# EAGLE board Calliope mini rev2.0 (EAGLE 7.7.0)
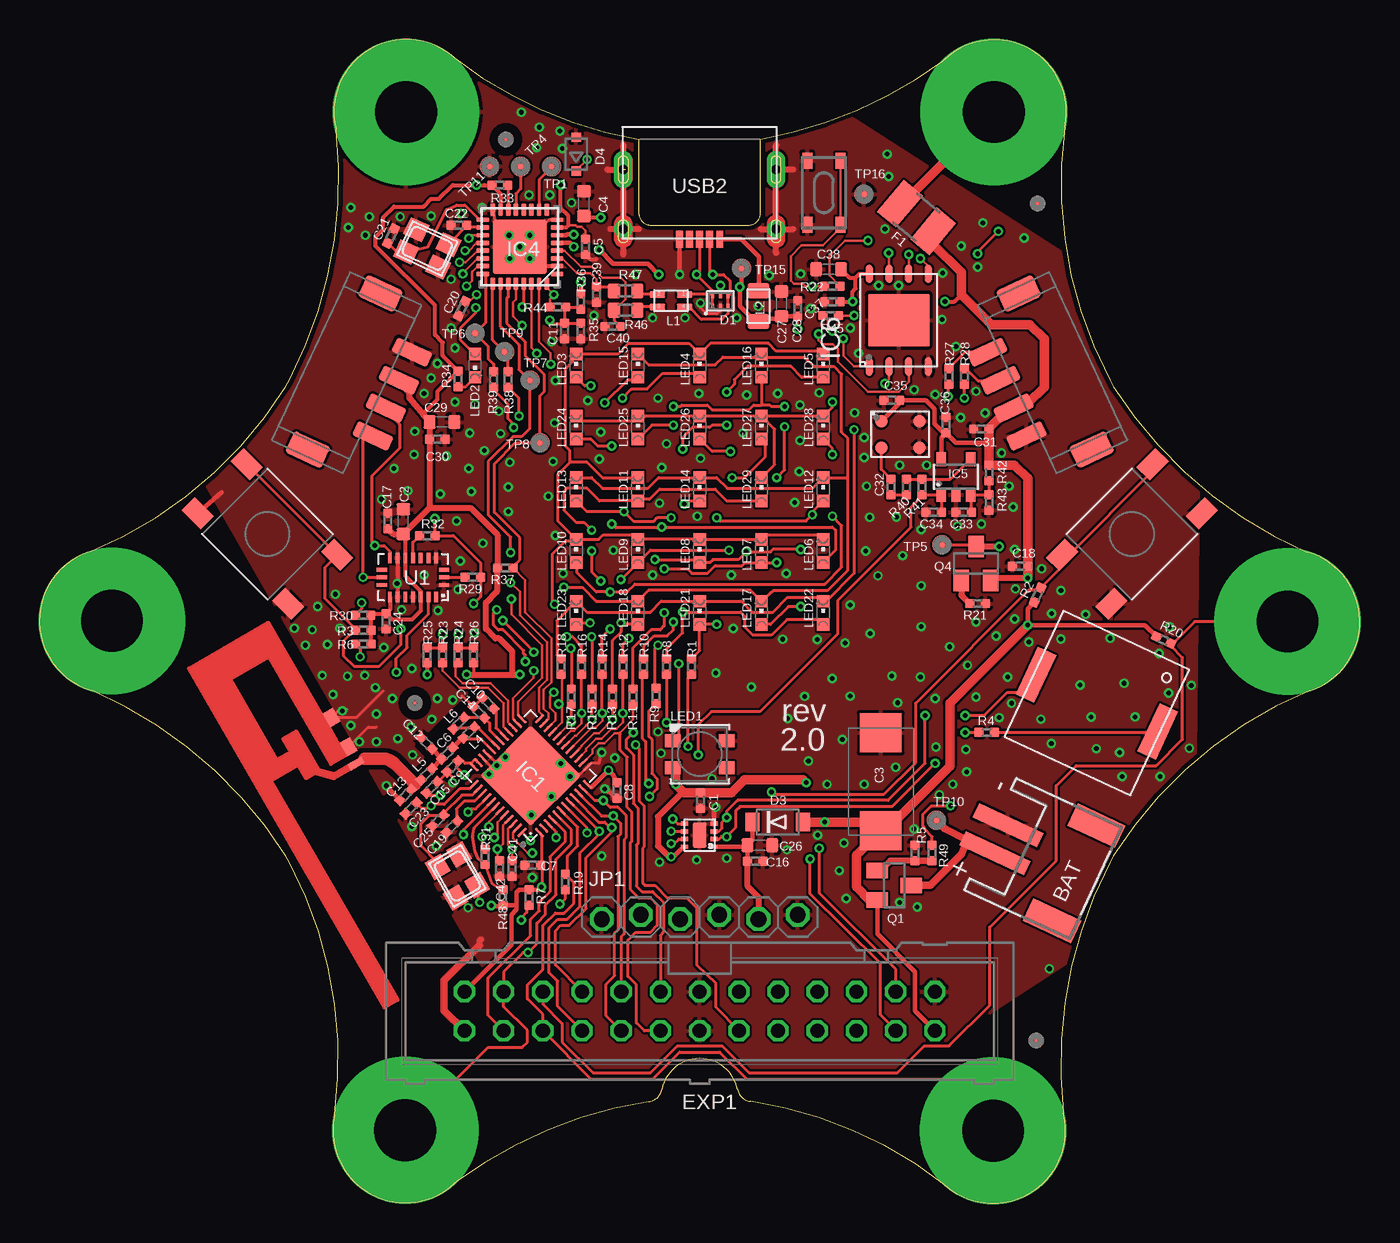
[diagram p3: board, top side]
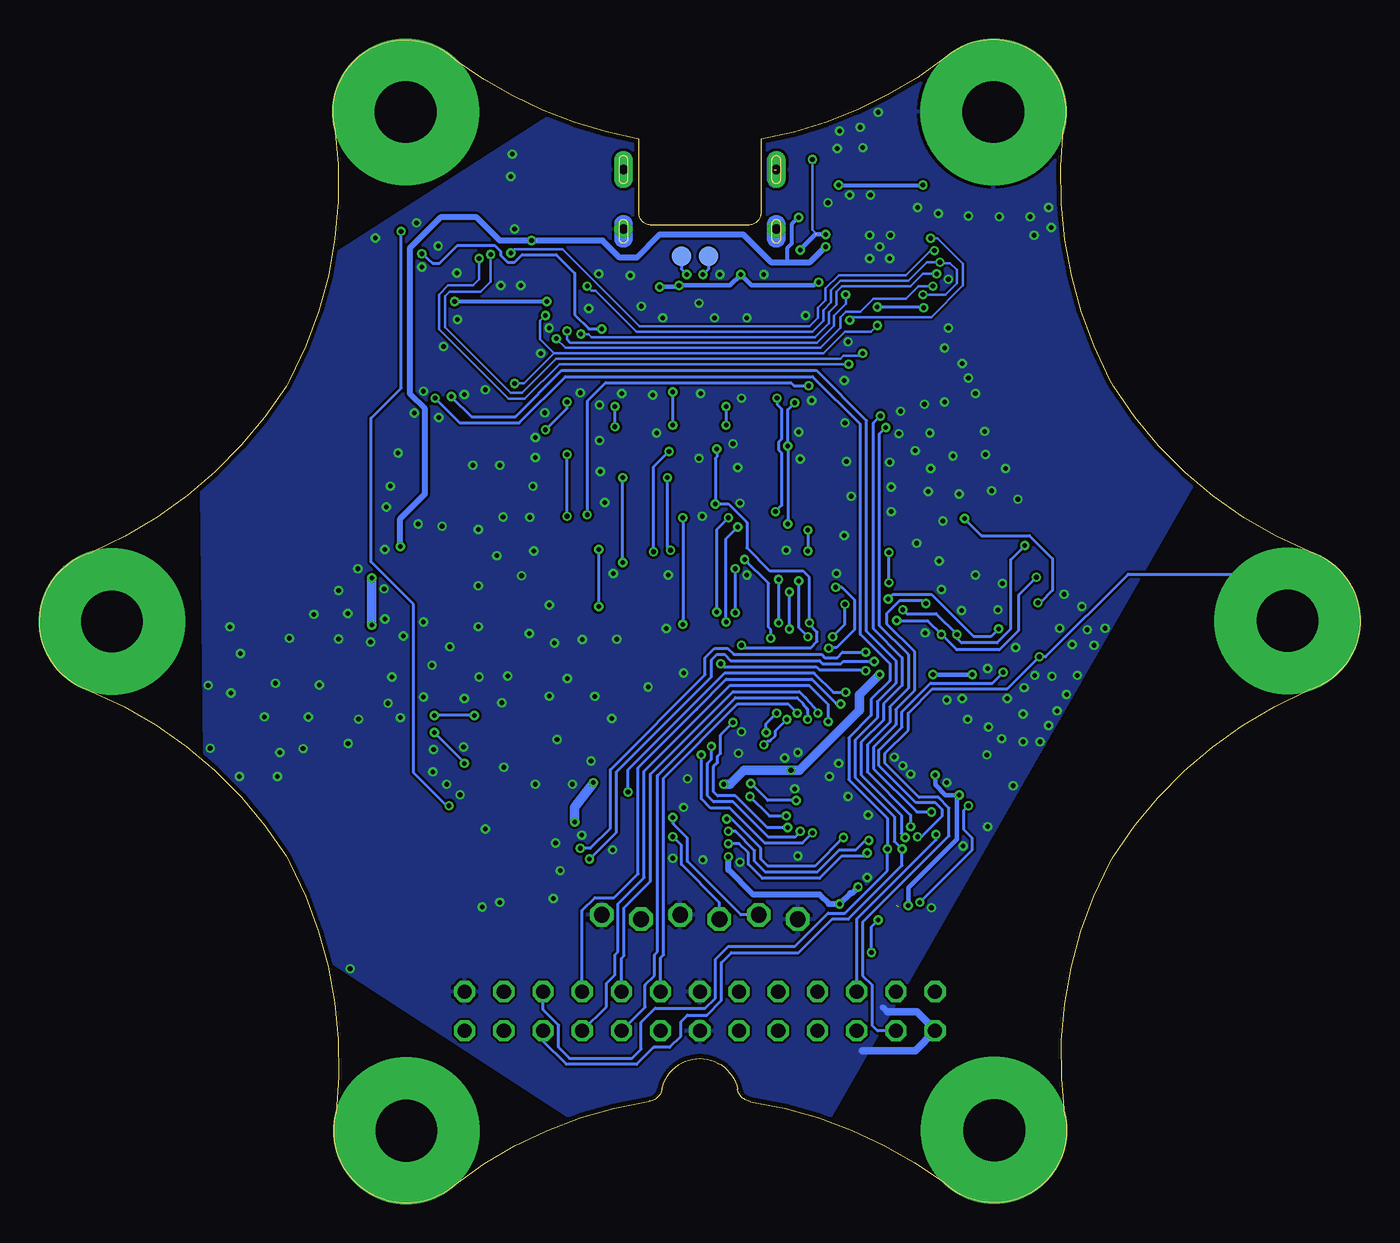
[diagram p4: board, bottom side, seen from below]

Size 85.54 x 75.36 mm. Coordinates in mm from the lower left corner, seen from the top.
Outline: 38.82,68.88 38.82,68.89
Outline: 46.72,64.13 arc-90 45.92,63.33 39.62,63.33 arc-90 38.82,64.13 38.82,68.89 arc-28 26.9,74.16 arc146 19.21,69.54 arc-34 16.21,53.31 15.96,52.87 arc-36 3.25,42.18 arc146 3.4,33.2 arc-34 15.96,22.5 16.21,22.05 arc-36 19.11,5.7 arc146 26.96,1.35 arc-28 39.49,6.57 arc70 40.32,7.36 arc-157 45.22,7.37 arc70 46.05,6.59 arc-29 58.64,1.2 arc146 66.33,5.83 arc-34 69.33,22.05 69.58,22.5 arc-36 82.3,33.18 arc146 82.14,42.16 arc-34 69.58,52.87 69.33,53.31 arc-36 66.43,69.66 arc146 58.58,74.01 arc-26 46.72,68.9 46.72,68.88
Copper layers (1*16): Top 0.035mm / dielectric 1.55mm / Bottom 0.035mm
Design rules "eC_2Layer_PClass6_BaseCopperO35 *": minimum track width 0.15mm, minimum drill 0.3mm, track to track 0.15mm, track to pad 0.15mm, pad to pad 0.15mm, via to via 0.15mm, smd to smd 0mil, copper to edge 0.3mm, drill to drill 0.35mm, minimum pad ring 0.175mm, minimum via ring 0.15mm, stop-mask expansion 0.05mm, vias tented up to drill 0.45mm, thermal gap 0.2mm
tKeepout: area 18,64.9 to 29.5,76.4; area 56.1,64.9 to 67.6,76.4; area 75.1,31.9 to 86.6,43.4; area 56,-1.1 to 67.5,10.4; area 18,-1 to 29.5,10.5; area 35.8,63.9 to 37.8,69.9; area 35.8,62.5 to 37.8,68.5; area 35.8,60.5 to 41.8,62.5; area 41.8,60.5 to 47.8,62.5; area 47.8,60.5 to 49.8,66.5; area 47.8,64.5 to 49.8,70.5; area 48.1,67.7 to 54.1,69.7; area 52.2,63.7 to 54.2,69.7; area 52.2,63.1 to 54.2,69.1; area 48.2,61.1 to 54.2,63.1; area 66.1,23.7 to 72.4,28.1; area 63,25.1 to 69.3,29.5; area 59.6,24.1 to 63.9,30.4; area 57.8,20.4 to 62.2,26.7; area 57,16.9 to 63.3,21.3; area 61.7,14.7 to 68,19.1; area 22.5,5.7 to 28.5,7.7; area 28.5,5.7 to 34.5,7.7; area 34.5,5.7 to 40.5,7.7; area 40.5,5.7 to 46.5,7.7; area 46.5,5.7 to 52.5,7.7; area 52.5,5.7 to 58.5,7.7; area 57.1,5.7 to 63.1,7.7; area 63.1,5.7 to 65.1,11.7; area 63.1,11.7 to 65.1,17.7; area 59.1,16.9 to 65.1,18.9; area 53.1,16.9 to 59.1,18.9; area 47.1,16.9 to 53.1,18.9; area 41.1,16.9 to 47.1,18.9; area 35.1,16.9 to 41.1,18.9; area 29.1,16.9 to 35.1,18.9; area 23.1,16.9 to 29.1,18.9; area 22.4,16.9 to 28.4,18.9; area 20.4,12.9 to 22.4,18.9; area 20.4,6.9 to 22.4,12.9; area 43.1,19.8 to 49.1,21.8; area 49.1,15.8 to 51.1,21.8; area 37.1,19.8 to 43.1,21.8; area 36.4,19.8 to 42.4,21.8; area 34.4,15.8 to 36.4,21.8; area 14.8,37.7 to 20.4,43.4; area 66.5,36.3 to 72.2,41.9; area 70.8,37.7 to 76.4,43.3; area 67.5,46.2 to 73.8,50.6; area 64.1,44.6 to 70.4,49; area 61.5,46.4 to 65.9,52.7; area 59.7,50.2 to 64.1,56.5; area 59,51.8 to 63.3,58.1; area 58.1,57.3 to 64.4,61.6; area 60.8,58.5 to 67.1,62.9; area 65.1,37.7 to 70.8,43.3; area 63.7,41.9 to 69.4,47.6; area 67.5,45.8 to 73.2,51.4; area 73.1,40.1 to 78.8,45.7; area 16.2,42 to 21.8,47.6; area 12.4,45.7 to 18.1,51.4; area 10.5,36.3 to 16.2,42; area 6.6,40.3 to 12.2,45.9; area 19.6,46.4 to 24,52.7; area 15.2,44.6 to 21.5,48.9; area 22.2,51.8 to 26.5,58.1; area 21.1,57.3 to 27.4,61.7; area 18.5,58.6 to 24.8,62.9; area -1,31.9 to 10.5,43.4
tRestrict: 4 lines

## Footprints (pad centres in the part's own frame; a part is rotated, then mirrored left to right if it is on the bottom)
JST-PH-2-SMT-RA = smd 1 x 4.6: 1 1,-3.7; 2 -1,-3.7 | smd 1.6 x 3.4: NC1 -3.4,1.5; NC2 3.4,1.5
0402 = smd 0.6 x 0.6: 1 -0.5,0; 2 0.5,0
0603 = smd 0.8 x 0.9: 1 -0.8,0; 2 0.8,0
D/7343-31R = smd 2.55 x 2.7: + 3.175,0; - -3.175,0
SOT886 = smd 0.325 x 0.27: 1 -0.338,0.5; 2 -0.338,0; 3 -0.338,-0.5; 4 0.338,-0.5; 5 0.338,0; 6 0.338,0.5
SOD-123FL = smd 0.91 x 1.22: A 1.637,0; C -1.637,0
SOD323-R = smd 0.6 x 0.6: A 1.1,0; C -1.1,0
ML26 = drill 0.914 octagon: 1 -15.24,-1.27; 2 -15.24,1.27; 3 -12.7,-1.27; 4 -12.7,1.27; 5 -10.16,-1.27; 6 -10.16,1.27; 7 -7.62,-1.27; 8 -7.62,1.27; 9 -5.08,-1.27; 10 -5.08,1.27; 11 -2.54,-1.27; 12 -2.54,1.27; 13 0,-1.27; 14 0,1.27; 15 2.54,-1.27; 16 2.54,1.27; 17 5.08,-1.27; 18 5.08,1.27; 19 7.62,-1.27; 20 7.62,1.27; 21 10.16,-1.27; 22 10.16,1.27; 23 12.7,-1.27; 24 12.7,1.27; 25 15.24,-1.27; 26 15.24,1.27
R1210 = smd 1.6 x 2.7: 1 -1.4,0; 2 1.4,0
1125S-SMT-XP = smd 1 x 2.5: 1 3,0.325; 2 1,0.325; 3 -1,0.325; 4 -3,0.325 | smd 1.55 x 2.6: P$1 5.575,-3.125; P$2 -5.575,-3.125
QFN48 = smd 0.8 x 0.2: 1 -3,2.2; 2 -3,1.8; 3 -3,1.4; 4 -3,1; 5 -3,0.6; 6 -3,0.2; 7 -3,-0.2; 8 -3,-0.6; 9 -3,-1; 10 -3,-1.4; 11 -3,-1.8; 12 -3,-2.2; 25 3,-2.2; 26 3,-1.8; 27 3,-1.4; 28 3,-1; 29 3,-0.6; 30 3,-0.2; 31 3,0.2; 32 3,0.6; 33 3,1; 34 3,1.4; 35 3,1.8; 36 3,2.2 | smd 0.2 x 0.8: 13 -2.2,-3; 14 -1.8,-3; 15 -1.4,-3; 16 -1,-3; 17 -0.6,-3; 18 -0.2,-3; 19 0.2,-3; 20 0.6,-3; 21 1,-3; 22 1.4,-3; 23 1.8,-3; 24 2.2,-3; 37 2.2,3; 38 1.8,3; 39 1.4,3; 40 1,3; 41 0.6,3; 42 0.2,3; 43 -0.2,3; 44 -0.6,3; 45 -1,3; 46 -1.4,3; 47 -1.8,3; 48 -2.2,3 | smd 4.65 x 4.65: GND 0,0
WSON8 = smd 0.28 x 0.5: 1 -0.75,-0.925; 2 -0.25,-0.925; 3 0.25,-0.925; 4 0.75,-0.925; 5 0.75,0.975; 6 0.25,0.975; 7 -0.25,0.975; 8 -0.75,0.975 | smd 1.6 x 0.9: EP 0,0
QFN_32_5X5X0P9 = smd 0.813 x 0.305: 1 -2.402,1.75; 2 -2.402,1.25; 3 -2.402,0.75; 4 -2.402,0.25; 5 -2.402,-0.25; 6 -2.402,-0.75; 7 -2.402,-1.25; 8 -2.402,-1.75; 17 2.402,-1.75; 18 2.402,-1.25; 19 2.402,-0.75; 20 2.402,-0.25; 21 2.402,0.25; 22 2.402,0.75; 23 2.402,1.25; 24 2.402,1.75 | smd 0.305 x 0.813: 9 -1.75,-2.402; 10 -1.25,-2.402; 11 -0.75,-2.402; 12 -0.25,-2.402; 13 0.25,-2.402; 14 0.75,-2.402; 15 1.25,-2.402; 16 1.75,-2.402; 25 1.75,2.402; 26 1.25,2.402; 27 0.75,2.402; 28 0.25,2.402; 29 -0.25,2.402; 30 -0.75,2.402; 31 -1.25,2.402; 32 -1.75,2.402 | smd 3.5 x 3.5: 33 0,0
SOT23-5 = smd 0.6 x 0.9: 1 -0.95,-1.15; 2 0,-1.15; 3 0.95,-1.15; 4 0.95,1.15; 5 -0.95,1.15
VQFN8_6X5 = smd 1.2 x 0.45: 1 -3,1.905; 2 -3,0.635; 3 -3,-0.635; 4 -3,-1.905; 5 3,-1.905; 6 3,-0.635; 7 3,0.635; 8 3,1.905 | smd 3.4 x 4: EP 0,0
1X06-OFF = drill 1.016 octagon: 1 -6.35,-0.14; 2 -3.81,0.14; 3 -1.27,-0.14; 4 1.27,0.14; 5 3.81,-0.14; 6 6.35,0.14
USB_2.0_FILTER_0805 = smd 1 x 0.45: 1 0.88,0.405; 2 -0.88,0.405; 3 -0.88,-0.405; 4 0.88,-0.405
FERRIT_0805 = smd 1 x 1.4: 1 -1,0; 2 1,0
LED3535 = smd 1 x 0.85: 1 -1.75,0.875; 2 -1.75,-0.875; 3 1.75,-0.875; 4 1.75,0.875
CHIPLED_0603 = smd 0.8 x 0.8: A 0,-0.75; C 0,0.75
SPU0410HR5H-PB = smd 0.8 x 0.8: 1 0.85,1.23; 2 0.85,-1.23; 3 -0.85,-1.23; 4 -0.85,1.23
BANANA_REC = drill 4 pad 9.5: 1 0,0
SOT23 = smd 1 x 1.4: 1 -0.95,-1.1; 2 0.95,-1.1; 3 0,1.1
NX3225 = smd 1.3 x 1.2: 1 -1.15,-0.8; 2 1.15,-0.8; 3 1.15,0.8; 4 -1.15,0.8
R0603 = smd 0.8 x 1: 1 -0.75,0; 2 0.75,0
PKMCS = smd 1.3 x 3.4: 1 -4.35,0; 2 4.35,0
PTS645S = smd 1.74 x 1.2: 1 -4.145,2.25; 2 4.145,2.25; 3 -4.145,-2.25; 4 4.145,-2.25
PTS810 = smd 1.05 x 0.65: 1 -2.075,1.075; 2 2.075,1.075; 3 -2.075,-1.075; 4 2.075,-1.075
B1,27 = smd 1.27 x 1.27: TP 0,0
BMX055 = smd 0.675 x 0.25: 1 1.262,1.5; 2 1.262,1; 3 1.262,0.5; 4 1.262,0; 5 1.262,-0.5; 6 1.262,-1; 7 1.262,-1.5; 11 -1.262,-1.5; 12 -1.262,-1; 13 -1.262,-0.5; 14 -1.262,0; 15 -1.262,0.5; 16 -1.262,1; 17 -1.262,1.5 | smd 0.25 x 0.675: 8 0.5,-2.013; 9 0,-2.013; 10 -0.5,-2.013; 18 -0.5,2.013; 19 0,2.013; 20 0.5,2.013
DN0007+0_MIRROR = smd 0.46 x 1 bottom: FEED 2.22,-2.8 | smd 1.01 x 0.74 bottom: GND -1.16,-2.93; GND@1 1.035,-2.93
FIDUCIAL_1MM = smd 1 x 1: 1 0,0
47642-0001 = smd 0.45 x 1.1: 1 -1.3,6.47; 2 -0.65,6.47; 3 0,6.47; 4 0.65,6.47; 5 1.3,6.47 | drill 0.6 pad 1.2 long: P$1 -4.95,1.95; P$3 4.95,1.95 | drill 0.6 pad 1.2: P$2 -4.95,5.8; P$4 4.95,5.8

## Placement (x,y rotation side)
BAT  S2B-PH-SM4-TB(LF)(SN)  [JST-PH-2-SMT-RA]  65.68,22 245 top
C1  100nF/25V/10%  [0402]  42.82,26.08 270 top
C2  10uF/16V/10%  [0603]  23.57,44.13 90 top
C3  100uF/6,3V/10%  [D/7343-31R]  54.5,27.29 270 top
C4  10uF/16V/10%  [0603]  35.27,64.73 90 top
C5  100nF/25V/10%  [0402]  35.37,61.93 270 top
C6  2,2pF/50V  [0402]  26.42,29.13 225 top
C7  100nF/25V/10%  [0402]  31.97,21.88 180 top
C8  100nF/25V/10%  [0402]  37.42,26.73 270 top
C9  1nF/25V/5%  [0402]  26.77,28.28 225 top
C10  47nF/25V/10%  [0402]  29.07,32.38 135 top
C11  100nF/25V/10%  [0402]  34.02,56.48 270 top
C12  1,0pF/50V  [0402]  25.07,29.78 135 top
C13  1,5pF/50V  [0402]  23.72,26.43 225 top
C14  2,2nF/25V/5%  [0402]  28.47,31.78 135 top
C15  100nF/25V/10%  [0402]  25.42,26.93 45 top
C16  100nF/25V/10%  [0402]  46.37,22.13 0 top
C17  100nF/25V/10%  [0402]  22.57,44.18 90 top
C18  100nF/25V/10%  [0402]  63.52,41.23 180 top
C19  100nF/25V/10%  [0402]  26.72,24.38 225 top
C20  100nF/25V/10%  [0402]  27.37,57.93 245 top
C21  12pF/50V/1%  [0402]  22.77,62.63 65 top
C22  12pF/50V/1%  [0402]  27.17,63.33 180 top
C23  12pF/50V/1%  [0402]  24.07,25.58 225 top
C24  100nF/25V/10%  [0402]  22.47,37.68 270 top
C25  12pF/50V/1%  [0402]  25.82,24.78 225 top
C26  10uF/16V/10%  [0603]  46.67,23.18 0 top
C27  10uF/16V/10%  [0603]  48.07,58.23 90 top
C28  100nF/25V/10%  [0402]  49.12,57.93 90 top
C29  10uF/16V/10%  [0603]  26.07,50.58 0 top
C30  100nF/25V/10%  [0402]  25.77,49.48 0 top
C31  100nF/25V/10%  [0402]  61.02,50.13 180 top
C32  100nF/25V/10%  [0402]  55.17,46.38 90 top
C33  100nF/25V/10%  [0402]  59.87,44.73 180 top
C34  100nF/25V/10%  [0402]  57.92,44.73 180 top
C35  100nF/25V/10%  [0402]  55.22,51.98 180 top
C36  100nF/25V/10%  [0402]  58.72,50.38 90 top
C37  100nF/25V/10%  [0402]  51.37,58.38 180 top
C38  10uF/16V/10%  [0603]  51.12,60.48 180 top
C39  47pF/16V/5%  [0402]  36.08,58.84 270 top
C40  47pF/16V/5%  [0402]  37.13,56.77 180 top
C41  100nF/25V/10%  [0402]  30.62,21.68 270 top
C42  100nF/25V/10%  [0402]  29.82,21.68 270 top
D1  PRTR5V0U2F  [SOT886]  44.11,58.42 90 top
D3  MBR1020VL  [SOD-123FL]  47.82,24.68 0 top
D4  [SOD323-R]  34.77,67.93 90 top
EXP1  [ML26]  42.77,12.43 180 top
F1  MICROSMDCH050F-02  [R1210]  56.82,63.83 140 top
I2C  1125S-SMT-XP  [1125S-SMT-XP]  22.57,52.53 245 top
IC1  NRF51822  [QFN48]  31.82,27.68 135 top
IC3  DRV8837  [WSON8]  42.77,23.83 90 top
IC4  MKL26Z128VFM4  [QFN_32_5X5X0P9]  31.12,61.93 180 top
IC5  MCP6001  [SOT23-5]  59.37,47.03 0 top
IC6  IS25LP128F  [VQFN8_6X5]  55.67,57.18 90 top
JP1  [1X06-OFF]  42.77,18.53 0 top
L1  2x47nH  [USB_2.0_FILTER_0805]  40.91,58.44 0 top
L2  MH2029-800Y  [FERRIT_0805]  46.58,58.09 270 top
L4  4,7nH  [0402]  27.82,30.48 45 top
L5  3,3nH  [0402]  25.07,27.78 225 top
L6  10nH  [0402]  27.17,31.08 225 top
LED1  SK6812MINI  [LED3535]  42.77,29.08 0 top
LED2  gelb  [CHIPLED_0603]  28.22,54.23 180 top
LED3  rot  [CHIPLED_0603]  34.77,54.23 0 top
LED4  rot  [CHIPLED_0603]  42.77,54.23 0 top
LED5  rot  [CHIPLED_0603]  50.77,54.23 0 top
LED6  rot  [CHIPLED_0603]  50.77,42.23 0 top
LED7  rot  [CHIPLED_0603]  46.77,42.23 0 top
LED8  rot  [CHIPLED_0603]  42.77,42.23 0 top
LED9  rot  [CHIPLED_0603]  38.77,42.23 0 top
LED10  rot  [CHIPLED_0603]  34.77,42.23 0 top
LED11  rot  [CHIPLED_0603]  38.77,46.23 0 top
LED12  rot  [CHIPLED_0603]  50.77,46.23 0 top
LED13  rot  [CHIPLED_0603]  34.77,46.23 0 top
LED14  rot  [CHIPLED_0603]  42.77,46.23 0 top
LED15  rot  [CHIPLED_0603]  38.77,54.23 0 top
LED16  rot  [CHIPLED_0603]  46.77,54.23 0 top
LED17  rot  [CHIPLED_0603]  46.77,38.23 0 top
LED18  rot  [CHIPLED_0603]  38.77,38.23 0 top
LED21  rot  [CHIPLED_0603]  42.77,38.23 0 top
LED22  rot  [CHIPLED_0603]  50.77,38.23 0 top
LED23  rot  [CHIPLED_0603]  34.77,38.23 0 top
LED24  rot  [CHIPLED_0603]  34.77,50.23 0 top
LED25  rot  [CHIPLED_0603]  38.77,50.23 0 top
LED26  rot  [CHIPLED_0603]  42.77,50.23 0 top
LED27  rot  [CHIPLED_0603]  46.77,50.23 0 top
LED28  rot  [CHIPLED_0603]  50.77,50.23 0 top
LED29  rot  [CHIPLED_0603]  46.77,46.23 0 top
MIC1  SPU0410HR5H-PB  [SPU0410HR5H-PB]  55.77,49.78 90 top
P_0  BANANA_PCB  [BANANA_REC]  4.7,37.71 0 top
P_1  BANANA_PCB  [BANANA_REC]  23.7,4.72 0 top
P_2  BANANA_PCB  [BANANA_REC]  61.78,4.69 0 top
P_3  BANANA_PCB  [BANANA_REC]  80.86,37.66 0 top
P_+3V  BANANA_PCB  [BANANA_REC]  61.84,70.65 0 top
P_GND  BANANA_PCB  [BANANA_REC]  23.75,70.66 0 top
Q1  DMG2305UX  [SOT23]  55.37,20.58 270 top
Q2  16.0 Mhz  [NX3225]  27.07,21.18 120 top
Q3  16.0 Mhz  [NX3225]  25.12,61.83 335 top
Q4  DMG2305UX  [SOT23]  60.67,41.43 0 top
R1  220R/1%  [0402]  42.24,34.74 90 top
R2  100K/1%  [0402]  64.66,39.39 245 top
R3  100K/1%  [0402]  20.98,37.09 0 top
R4  0R  [0402]  61.37,30.48 0 top
R5  680k/1%  [0402]  56.72,22.68 270 top
R6  3,3M/1%  [0402]  20.99,36.21 0 top
R7  3,3M/1%  [0402]  31.73,19.79 90 top
R8  220R/1%  [0402]  40.62,34.74 90 top
R9  220R/1%  [0402]  39.95,32.84 90 top
R10  220R/1%  [0402]  39.13,34.74 90 top
R11  220R/1%  [0402]  38.46,32.79 90 top
R12  220R/1%  [0402]  37.8,34.74 90 top
R13  220R/1%  [0402]  37.13,32.79 90 top
R14  220R/1%  [0402]  36.46,34.74 90 top
R15  220R/1%  [0402]  35.79,32.79 90 top
R16  0R  [0402]  35.12,34.74 90 top
R17  0R  [0402]  34.46,32.79 90 top
R18  0R  [0402]  33.79,34.74 90 top
R19  3,3M/1%  [0402]  34.07,20.79 270 top
R20  3,3M/1%  [0402]  72.83,36.47 155 top
R21  680k/1%  [0402]  60.77,38.83 180 top
R22  10K/1%  [0402]  51.37,59.38 0 top
R23  0R  [0402]  26.12,35.48 90 top
R24  0R  [0402]  27.12,35.48 90 top
R25  2,2K/1%  [0402]  25.12,35.48 270 top
R26  2,2K/1%  [0402]  28.12,35.48 270 top
R27  100R/1%  [0402]  58.92,53.53 90 top
R28  100R/1%  [0402]  59.92,53.53 90 top
R29  10K/1%  [0402]  28.07,40.53 180 top
R30  100K/1%  [0402]  20.97,38.08 0 top
R31  10K/1%  [0402]  28.87,22.43 270 top
R32  10K/1%  [0402]  25.12,43.23 180 top
R33  10K/1%  [0402]  29.82,65.93 180 top
R34  2,2K/1%  [0402]  27.12,53.38 90 top
R35  10K/1%  [0402]  35.07,56.48 90 top
R36  10K/1%  [0402]  35.07,58.38 90 top
R37  [0402]  30.17,41.13 180 top
R38  1K/5%  [0402]  30.37,53.33 270 top
R39  1K/5%  [0402]  29.42,53.33 270 top
R40  10K/1%  [0402]  56.17,46.38 270 top
R41  1M/1%  [0402]  57.17,46.38 90 top
R42  100K/1%  [0402]  61.52,47.28 90 top
R43  100K/1%  [0402]  61.52,45.38 90 top
R44  0R  [0402]  33.57,58.03 180 top
R45  100R/1%  [0402]  51.27,57.48 0 top
R46  10R/1%  [R0603]  37.98,57.82 180 top
R47  10R/1%  [R0603]  37.98,59.07 180 top
R48  100K/1%  [0402]  30.02,19.78 270 top
R49  390k/1%  [0402]  57.82,22.68 270 top
SERIAL  1125S-SMT-XP  [1125S-SMT-XP]  62.97,52.53 115 top
SPK1  PKMCS0909E4000-R1  [PKMCS]  68.5,32.38 335 top
TAST_A  PTS645S blue  [PTS645S]  14.77,43.33 135 top
TAST_B  PTS645S red  [PTS645S]  70.77,43.33 225 top
TAST_RESET  PTS810SJ  [PTS810]  50.82,65.43 90 top
TP1  PTR1B1,27  [B1,27]  33.17,67.13 180 top
TP4  PTR1B1,27  [B1,27]  31.17,67.13 180 top
TP5  PTR1B1,27  [B1,27]  58.47,42.63 180 top
TP6  PTR1B1,27  [B1,27]  28.22,56.33 0 top
TP7  PTR1B1,27  [B1,27]  31.77,53.28 0 top
TP8  PTR1B1,27  [B1,27]  32.42,49.23 0 top
TP9  PTR1B1,27  [B1,27]  30.12,55.13 0 top
TP10  PTR1B1,27  [B1,27]  58.12,24.78 0 top
TP11  PTR1B1,27  [B1,27]  29.17,67.13 0 top
TP13  PTR1B1,27  [B1,27]  42.22,61.33 0 bottom
TP14  PTR1B1,27  [B1,27]  43.97,61.33 0 bottom
TP15  PTR1B1,27  [B1,27]  45.47,60.53 90 top
TP16  PTR1B1,27  [B1,27]  53.42,65.33 0 top
U1  BMX055  [BMX055]  24.2,40.53 270 top
U$2  INVERTED_F_ANTENNA  [DN0007+0_MIRROR]  16.97,28.98 240 bottom
U$5  FIDUCIAL  [FIDUCIAL_1MM]  64.57,10.53 0 top
U$6  FIDUCIAL  [FIDUCIAL_1MM]  30.22,68.88 0 top
U$7  FIDUCIAL  [FIDUCIAL_1MM]  64.67,64.73 0 top
U$8  FIDUCIAL  [FIDUCIAL_1MM]  24.32,32.38 0 top
USB2  47642-0001  [47642-0001]  42.77,68.88 180 top

## Tracks (layer width: path | path; a pad name or v marks a point on that pad's centre or on a via)
+5V  (via drill 0.3)  (1 unrouted)
  Top 0.15: v35.47,67.58 34.77,66.88 D4.C
  Top 0.2: D1.5 44.11,59.32 v44.12,59.43 | R49.1 57.82,23.73 57.32,24.23 57.32,24.33 57.22,24.43 57.22,25.18 57.77,25.73 v59.02,25.73 | v62.12,62.93 60.77,61.58 v60.77,61.48 | v49.12,56.61 C28.1
  Top 0.3: TP15.TP 45.47,59.48 v45.37,59.33 45.37,58.08 46.12,57.33 46.34,57.33 L2.2 46.93,57.09 47.12,57.28 47.92,57.28 C27.1 C28.1 | v35.07,59.63 R36.2 | v40.12,60.13 39.42,60.83 37.17,60.83 v36.27,61.73 | IC4.6 34.12,62.68 | 34.12,62.68 | 34.12,62.68 34.17,62.73 v34.62,62.73
  Bottom 0.15: 35.22,62.78 35.47,63.03 v35.47,67.58
  Bottom 0.2: v59.02,25.73 59.17,25.73 61.32,27.88 61.32,38.78 64.07,41.53 64.07,50.83 62.12,52.78 v62.12,62.93 | v60.77,61.48 60.07,60.88 59.62,60.88 58.47,62.03 56.07,62.03 55.67,61.63 55.67,61.38 55.22,60.93 54.77,60.93 54.27,61.43 52.07,61.43 50.87,60.23 50.87,57.53 49.95,56.61 v49.12,56.61
  Bottom 0.3: v45.37,59.33 44.22,59.33 v44.12,59.43 40.82,59.43 v40.12,60.13 39.42,59.43 35.37,59.43 v35.07,59.63 | v36.27,61.73 35.27,62.73 v34.62,62.73
FL_CS  (via drill 0.3)
  Top 0.15: IC4.23 28.37,60.68 28.02,60.33 28.02,59.73 v27.67,59.38 | IC6.1 52.76,54.18 52.07,54.87 v52.07,55.98
  Bottom 0.15: v27.67,59.38 28.62,59.38 29.42,58.58 31.52,58.58 32.37,57.73 33.32,57.73 33.67,57.38 33.67,56.68 34.97,55.38 51.47,55.38 v52.07,55.98
FL_RESET  (via drill 0.3)
  Top 0.15: IC4.20 28.32,62.18 27.82,61.68 v27.57,61.68 | v55.02,61.53 55.02,60.2 IC6.7
  Bottom 0.15: v27.57,61.68 27.82,61.68 29.42,60.08 33.77,60.08 34.62,59.23 34.62,58.48 35.12,57.98 35.12,57.33 35.67,56.78 46.67,56.78 51.67,61.78 54.77,61.78 v55.02,61.53
FL_W  (via drill 0.3)
  Top 0.15: IC4.22 28.37,61.18 27.42,60.23 v27.42,60.18 | IC6.3 56.32,54.17 56.32,53.18 55.67,52.53 53.67,52.53 51.72,54.48 51.72,55.33 51.42,55.63 50.72,55.63 50.47,55.88 v50.47,56.28
  Bottom 0.15: v27.42,60.18 28.32,60.18 29.12,59.38 33.57,59.38 33.92,59.03 33.92,58.18 34.42,57.68 34.42,56.98 35.32,56.08 49.77,56.08 49.97,56.28 v50.47,56.28
GND  (via drill 0.3 pad 0.6)  (1 unrouted)
  Top 0.2: 19.92,31.98 19.46,31.98 U$2.GND 20.54,31.45 22.27,33.18 | IC4.16 29.47,63.73 v30.42,62.68 | IC4.8 33.02,63.68 32.77,63.43 | D1.2 44.11,57.82 43.87,57.58 43.22,57.58 42.82,57.98 v42.82,58.28 | IC1.33 29.61,28.48 v29.62,28.33 29.87,28.43 29.57,28.13 29.39,28.13 IC1.34 | v34.37,27.63 34.52,27.63 34.67,27.78 35.03,27.78 IC1.13 35.73,28.48 36.22,28.48 v36.42,29.18 | C7.2 31.52,21.88 | C42.2 29.92,21.18 | U$2.GND@1 21.31,30.83 21.82,30.83 | C15.2 25.82,27.29 26.42,27.89 C9.2 26.77,27.57 v26.77,27.23 | C10.2 C14.2 27.4,32.86 27.37,32.86
  Top 0.25: U1.12 U1.6 | C5.2 35.67,61.13 36.07,61.13
  Top 0.254: IC4.2 32.37,60.68 IC4.33
  Top 0.3: USB2.5 v41.47,60.13 | IC3.4 43.7,25.51 v43.82,25.63 | TAST_A.2 11.81,46.03 | C8.2 37.32,26.23 36.92,26.63 36.82,26.63 v36.62,26.83 | C13.2 22.71,26.73 v22.47,27.03
  Top 0.4: 28.57,17.08 28.62,17.08 | 28.47,16.68 28.57,16.68 28.52,16.73 28.52,17.03 | 36.77,66.93 37.97,66.93 | 38.82,63.08 USB2.P$4 | USB2.P$4 36.97,63.08 | 37.82,68.53 USB2.P$4 | USB2.P$4 37.82,61.43 | 47.72,61.53 USB2.P$2 | USB2.P$2 USB2.P$1 | USB2.P$1 47.72,68.53 | 48.82,66.93 USB2.P$1 | 46.72,63.08 USB2.P$2 | USB2.P$2 48.82,63.08
  Top 0.5: EXP1.26 26.22,12.47 26.22,14.43 28.47,16.68
  Bottom 0.4: 30.62,12.38 30.92,12.68
  Bottom 0.5: EXP1.26 28.81,9.88 32.22,9.88 | 27.52,11.18 28.72,12.38 30.62,12.38
  other vias: 23.46,38.42 27.27,41.58 30.47,47.98 30.37,46.38 31.12,61.93 31.77,62.68 30.47,61.18 31.77,61.18 22.32,35.98 24.07,30.83 27.12,39.73 27.02,44.18 16.52,37.23 17.67,37.13 18.32,34.18 19.02,32.93 19.62,31.88 20.17,30.93 20.72,29.88 22.17,45.58 20.02,63.18 31.22,70.64 32.39,69.67 59.72,61.98 74.49,29.46 74.62,33.53 72.6,27.62 69.35,36.58 64.92,41.08 55.6,32.4 52.02,30.03 55.47,28.23 56.67,24.23 52.27,19.73 59.17,27.13 50.39,36.51 62.72,34.08 66.17,39.68 59.67,50.88 61.12,63.48 43.82,34.33 48.15,36.51 52.19,36.27 53.52,42.23 53.42,48.28 53.42,49.58 33.17,55.78 21.07,34.18 30.17,28.88 29.12,27.78 70.97,31.49 49.58,32.82 24.27,48.48 25.97,45.93 27.97,46.08 58.3,26.45 53.58,46.42 59.37,55.47 23.37,63.88 57.12,37.33 55.22,34.13 52.52,32.83 58.51,60.23 48.47,31.38 51.02,27.13 53.42,27.13 49.82,28.63 46.12,33.43 52.12,23.33 22.97,47.58 25.77,54.38 28.22,51.73 26.37,48.38 25.37,63.93 33.87,68.29 33.42,43.23 52.52,38.73 54.32,40.63 60.02,29.38 60.67,32.78 58.07,29.53 60.12,34.83 67.77,38.13 63.17,42.33 57.12,43.63 27.77,19.13 53.82,36.88 62.82,46.43 69.97,29.18 68.12,31.48 62.17,31.44 55.52,44.43 57.12,39.98 50.42,23.83 42.57,22.23 28.72,42.73 25.82,38.38 33.27,48.03 28.82,48.73 30.37,44.78 23.87,46.13 21.12,62.68 21.37,63.88 27.32,64.08 24.92,52.43 26.67,56.68 24.32,49.98 62.32,48.58 55.72,47.78 57.47,47.78 53.78,44.42 26.67,59.83 20.17,64.48 33.07,65.28 33.72,69.43 32.21,68.35 34.47,64.78 36.37,49.93 40.62,49.18 40.32,47.63 45.57,49.88 49.27,49.38 49.22,47.38 42.82,48.23 55.92,41.93 38.62,60.13 26.92,55.38 26.92,51.88 27.87,49.88 29.77,51.28 55.02,66.48 54.92,67.93 54.77,63.08 35.92,57.48 45.17,57.33 41.82,57.33 39.72,57.33 52.82,51.18 50.52,52.48 54.37,59.43 47.27,60.08 49.97,57.93 55.72,19.48 24.12,24.38 60.07,27.93 51.82,21.53 73.21,37.32 28.67,64.48 25.37,53.43 27.82,47.58 29.87,49.83 63.07,45.08 61.02,43.98 59.47,43.83 63.22,39.78 65.57,38.18 66.17,36.53 62.97,32.37 64.87,31.34 65.55,29.77 68.47,29.43 70.14,27.63 48.92,45.38 42.62,44.48 33.92,40.78 37.17,42.28 40.17,45.33 49.27,51.68 23.17,40.13 24.92,40.68 24.12,34.63 21.77,33.38 22.87,32.68 19.47,37.23 18.02,38.63 19.17,39.43 48.42,22.88 25.77,32.68 18.65,36.18 61.27,51.17 72.53,35.59 73.15,33.04 67.41,33.55 70.27,33.67 64.1,36.34 63.79,62.5 58.47,57.22 58.02,52.37 28.17,36.93 31.92,21.08 25.42,31.33 23.22,30.08 40.07,30.53 21.82,31.68 19.96,34.12 21.82,29.88 31.87,25.13 33.17,26.33 36.42,22.48 43.57,27.48 40.27,29.13 33.77,28.48 40.17,22.08 25.72,23.13 26.77,32.58 24.17,29.03 44.52,22.33 44.94,37.21 51.35,33.97 35.52,51.98 39.72,40.68 44.82,40.68 40.07,52.13 42.72,52.43 45.82,52.33 47.82,52.43 48.37,40.78 65.42,15.18 60.67,52.58 56.87,19.18 63.17,37.83 61.97,36.73 60.67,37.63 58.02,32.68 57.07,34.08 58.97,36.03 32.97,45.78 37.27,28.83 60.77,60.63 36.27,48.18 33.42,53.28 33.37,50.53 17.22,36.13 52.53,56.67 56.67,52.67 49.32,60.18 55.67,59.43 53.07,55.03 31.72,65.28 46.57,58.08
  pour Bottom: 34.37,5.48 8.07,51.28 19.47,65.78 18.47,72.78 23.07,76.28 27.07,76.28 32.87,70.48 52.47,70.38 66.37,61.48 75.07,46.18 74.87,29.08 66.57,15.58 51.37,5.68 arc0 34.67,4.98
  pour Top: 8.07,51.28 19.47,65.78 18.47,72.78 23.07,76.28 27.07,76.28 32.87,70.48 32.77,70.48 52.47,70.38 66.37,61.48 75.07,46.18 74.87,29.08 66.57,15.58 51.37,5.68 arc1 34.67,4.98
LED_C1  (via drill 0.3 pad 0.6)
  Top 0.2: R1.2 42.77,35.78 LED21.A v43.87,37.48 | LED12.A 50.07,44.78 v50.07,44.58 49.67,44.18 44.07,44.18 v43.87,44.38 | v35.72,52.93 35.32,52.93 LED3.A
  Bottom 0.2: v50.07,44.58 50.07,51.93 48.87,53.13 36.87,53.13 36.67,52.93 v35.72,52.93 | v43.87,44.38 v43.87,37.48
LED_C2  (via drill 0.3 pad 0.6)
  Top 0.2: LED13.A 35.47,44.78 v37.87,44.78 38.52,44.13 39.77,44.13 40.02,44.38 v40.92,44.38 | R8.2 40.67,35.4 40.67,35.93 41.67,36.93 v41.67,38.28 45.42,38.28 45.72,37.98 45.72,37.28 46.22,36.78 47.42,36.78 48.42,37.78 50.47,37.78 LED22.A | LED4.A 42.52,53.73 40.37,53.73 39.37,52.73 38.37,52.73 v37.77,52.13
  Bottom 0.2: v41.67,38.28 41.67,43.63 v40.92,44.38 | v37.77,52.13 37.77,51.73 37.47,51.43 37.47,49.48 37.67,49.28 37.67,48.78 37.47,48.58 37.47,45.18 v37.87,44.78
LED_C3  (via drill 0.3, 0.3 pad 0.6)
  Top 0.2: LED5.A 49.37,53.48 48.67,54.18 45.87,54.18 45.02,53.33 45.02,53.03 v44.52,52.53 | v41.77,45.28 41.97,45.48 LED14.A | LED23.A 34.87,37.58 v35.67,37.58 | R9.2 39.87,33.45 39.87,35.93 v40.07,36.13 | v44.52,50.38 43.57,50.38 43.42,50.23 42.32,50.23 41.67,49.58 v41.67,48.83
  Bottom 0.2: v40.07,36.13 39.92,35.98 35.57,35.98 35.17,36.38 35.17,36.98 35.67,37.48 v35.67,37.58 35.67,40.53 36.07,40.93 38.22,40.93 39.72,42.43 39.72,44.08 40.92,45.28 v41.77,45.28 41.77,48.23 41.67,48.33 v41.67,48.83 | v44.52,50.38 v44.52,52.53
LED_C4  (via drill 0.3, 0.3 pad 0.6)
  Top 0.2: LED6.A 51.57,42.28 51.57,43.58 51.37,43.78 v40.32,43.78 40.27,43.73 37.32,43.73 v37.07,43.98 | R10.2 39.17,35.28 39.17,36.08 39.82,36.73 40.67,36.73 41.07,37.13 v41.07,37.63 | v36.62,51.83 38.12,53.33 38.62,53.33 LED15.A | v37.07,49.03 36.17,49.03 35.72,49.48 LED24.A
  Bottom 0.2: v37.07,43.98 v37.07,49.03 37.07,51.38 v36.62,51.83 | v41.07,37.63 41.07,43.03 v40.32,43.78
LED_C5  (via drill 0.3 pad 0.6)
  Top 0.2: LED25.A 39.67,50.38 v41.07,50.38 | LED7.A v47.77,41.48 | v47.77,46.98 48.27,47.48 v48.27,50.28 | LED7.A 46.77,41.38 | R11.2 38.46,35.97 39.62,37.13 40.22,37.13 40.47,37.38 v40.47,38.23 | v48.27,51.58 47.42,51.58 47.32,51.68 46.77,51.68 | v41.07,51.58 41.52,51.58 41.62,51.68 43.27,51.68 43.57,51.38 45.97,51.38 46.27,51.68 46.77,51.68 | LED16.A 46.77,51.68 | v40.47,41.08 41.97,41.08 42.27,40.78 43.27,40.78 43.77,41.28 45.52,41.28 45.72,41.48 LED7.A
  Bottom 0.2: v41.07,51.58 v41.07,50.38 | v47.77,41.48 v47.77,46.98 | v48.27,50.28 v48.27,51.58 | v40.47,38.23 v40.47,41.08
LED_C6  (via drill 0.3 pad 0.6)
  Top 0.2: v44.77,48.68 43.57,48.68 LED26.A | R12.2 37.8,36.21 v38.17,36.58 | v39.87,41.68 42.77,41.68 LED8.A 43.42,41.48 43.62,41.68 45.27,41.68 v45.77,42.18 47.37,42.18 47.52,42.33 v49.32,42.33 | v49.32,38.63 48.52,38.63 47.37,37.48 LED17.A
  Bottom 0.2: v49.32,42.33 v49.32,38.63 | v45.77,42.18 45.77,47.68 v44.77,48.68 | 39.67,41.48 v39.87,41.68 38.32,40.13 38.32,37.28 38.17,37.13 v38.17,36.58
LED_C7  (via drill 0.3 pad 0.6)
  Top 0.2: R13.2 37.13,36.44 37.67,36.98 v37.67,37.58 37.77,37.48 LED18.A | v37.67,40.38 LED9.A 39.57,42.28 v44.67,42.28 | v44.87,46.98 45.67,46.98 47.02,48.33 47.02,49.23 LED27.A
  Bottom 0.2: v37.67,40.38 v37.67,37.58 | v44.67,42.28 44.87,42.48 v44.87,46.98
LED_C8  (via drill 0.3 pad 0.6)
  Top 0.2: R14.2 36.46,36.67 v36.97,37.18 | v51.37,44.48 51.97,43.88 51.97,41.18 50.87,40.08 38.57,40.08 38.07,39.58 v36.97,39.58 36.07,39.58 34.82,40.83 34.82,41.43 LED10.A | v51.37,48.48 51.37,48.88 LED28.A
  Bottom 0.2: v36.97,37.18 v36.97,39.58 | v51.37,44.48 v51.37,48.48
LED_C9  (via drill 0.3 pad 0.6)
  Top 0.2: LED29.A 44.52,45.48 43.77,46.23 40.17,46.23 39.52,45.58 38.87,45.58 LED11.A 36.27,45.48 35.47,46.28 34.17,46.28 33.97,46.08 33.97,44.88 34.77,44.08 35.27,44.08 v35.77,43.58 | v35.77,42.23 35.77,40.88 v36.37,40.28 | v35.77,36.68 35.79,36.5 R15.2
  Bottom 0.2: v35.77,43.58 v35.77,42.23 | v36.37,40.28 36.37,37.28 v35.77,36.68
LED_R1  (via drill 0.3 pad 0.6)
  Top 0.2: LED10.C 33.57,44.18 33.57,47.18 34.37,47.98 | LED11.C 36.47,46.98 35.47,47.98 34.37,47.98 | LED10.C 36.22,42.98 36.52,43.28 38.47,43.28 LED9.C | v33.37,38.78 33.22,38.93 33.22,42.03 34.07,42.88 34.67,42.88 LED10.C | R16.2 35.12,36.08 34.52,36.68 v34.17,36.68 | LED9.C 38.77,43.03 39.02,43.28 | LED6.C 50.47,43.28 46.77,43.28 LED7.C LED8.C LED9.C | LED5.C 50.57,55.18 47.72,55.18 47.22,55.68 43.47,55.68 LED4.C 42.07,55.68 38.17,55.68 37.47,54.98 LED3.C 34.52,54.73 34.52,54.48 34.07,54.03 34.07,49.03 34.37,48.73 34.37,47.98
  Bottom 0.2: v33.37,38.78 33.37,37.48 v34.17,36.68
LED_R2  (via drill 0.3 pad 0.6)
  Top 0.2: LED15.C 39.47,54.28 43.77,54.28 44.27,54.78 46.57,54.78 | 46.57,54.78 LED16.C | LED13.C 35.77,46.98 36.47,46.28 39.42,46.28 40.12,46.98 LED14.C 43.87,46.98 44.57,46.28 50.07,46.28 LED12.C 52.32,46.98 52.37,47.03 | 46.57,54.78 49.57,54.78 50.17,54.18 51.47,54.18 51.97,53.68 51.97,49.93 52.37,49.53 52.37,47.03 | v33.97,39.88 35.17,39.88 36.07,38.98 LED18.C 39.47,39.68 46.07,39.68 LED17.C 47.57,39.68 51.07,39.68 52.37,40.98 52.37,47.03 | v34.42,35.93 34.47,35.88 34.47,33.41 R17.2
  Bottom 0.2: v33.97,39.88 33.57,39.88 32.77,39.08 32.77,37.13 33.92,35.98 34.37,35.98 v34.42,35.93
LED_R3  (via drill 0.3 pad 0.6)
  Top 0.2: LED25.C 39.27,50.98 | 39.27,50.98 LED26.C LED27.C | LED27.C LED28.C 50.82,50.98 51.37,51.53 v51.37,51.88 | LED29.C 47.62,47.83 47.62,50.13 LED27.C | v52.77,50.08 52.77,40.78 50.97,38.98 LED22.C 50.52,39.23 48.47,39.23 47.52,38.28 46.17,38.28 45.47,38.98 LED21.C 40.27,38.98 39.57,38.28 35.47,38.28 LED23.C 33.52,37.73 33.52,35.51 R18.2 | LED24.C 35.07,50.68 38.97,50.68 39.27,50.98
  Bottom 0.2: v52.77,50.08 51.37,51.48 v51.37,51.88
MISO  (via drill 0.3)
  Top 0.15: IC4.32 32.87,59.28 v33.32,58.83 33.07,58.58 R44.2 | R45.1 51.07,57.18 51.07,56.78 v51.37,56.48
  Bottom 0.15: v33.32,58.83 33.32,58.23 34.07,57.48 34.07,56.83 35.17,55.73 51.17,55.73 51.37,55.93 v51.37,56.48
MISO_FL  (via drill 0.3)
  Top 0.15: IC4.28 30.87,58.53 30.67,58.33 30.67,57.43 v31.27,56.83 | IC6.2 55.04,53.35 v54.77,53.08 | R45.2 v52.77,57.48
  Top 0.2: IC4.28
  Bottom 0.15: v31.27,56.83 31.67,56.43 33.37,56.43 34.77,55.03 52.22,55.03 | v54.77,53.08 54.17,53.08 52.22,55.03 | 52.22,55.03 53.12,55.93 53.12,57.13 v52.77,57.48
MOSI  (via drill 0.3)
  Top 0.15: IC4.31 32.37,55.78 33.12,55.03 v33.12,54.33 | IC6.5 57.58,60.68 v57.07,61.18
  Top 0.2: IC4.31
  Bottom 0.15: v33.12,54.33 51.87,54.33 54.12,52.08 55.17,52.08 59.67,56.58 59.67,58.83 59.07,59.43 57.47,59.43 57.07,59.83 v57.07,61.18 57.07,60.73
N$1  (via drill 0.3 pad 0.6)
  Top 0.2: v57.37,31.58 57.37,28.48 54.97,26.08 45.22,26.08 44.52,25.38 v44.52,24.98 44.22,24.68 44.22,24.28 44.02,24.08 IC3.3 | v59.97,31.58 61.22,31.58 62.72,33.08 63.8,33.08 SPK1.1
  Bottom 0.2: v57.37,31.58 v59.97,31.58 | JP1.2 40.11,18.67 43.57,22.13 43.57,23.63 44.52,24.58 v44.52,24.98
N$2
  Top 0.2: 25.92,22.33 25.87,21.98 25.87,21.85 Q2.3 25.8,22.05 24.72,23.13 24.72,24.58 25.27,25.14 C25.1 26.17,25.24 27.37,26.43 28.02,26.43 IC1.38
N$3
  Top 0.2: U1.19 R29.2
N$4
  Top 0.2: R33.1 30.37,65.88 IC4.14
N$5  (via drill 0.3)
  Top 0.2: LED2.A 28.22,54.93 27.27,55.88 27.27,56.68 28.27,57.68 v28.27,57.98 | IC4.29 | IC4.29 31.37,58.13 v31.27,58.03
  Bottom 0.2: v28.27,57.98 28.37,58.03 v31.27,58.03
N$6
  Top 0.2: U1.14 24.2,42.81 R32.2
N$7
  Top 0.4: R5.2 55.12,22.18 54.47,21.53 Q1.1
  Top 0.406: R49.2 R5.2
N$8
  Top 0.2: R34.1 27.62,52.88 LED2.C
N$9
  Top 0.6: P_+3V.1 55.85,64.67 F1.2
N$10  (via drill 0.3 pad 0.6)
  Top 0.2: v59.97,30.48 R4.1 | v58.02,28.48 55.22,25.68 45.37,25.68 45.12,25.43 45.12,24.33 v44.52,23.73 44.17,23.73 44.02,23.58 IC3.2
  Bottom 0.2: JP1.3 41.5,19.46 43.97,21.93 43.97,23.18 v44.52,23.73 | v59.97,30.48 58.02,28.53 v58.02,28.48
N$11
  Top 0.2: IC4.18 27.82,63.18 C22.1 27.67,63.28 26.62,62.23 26.62,62.19 Q3.3
N$12
  Top 0.2: R4.2 72.38,30.48 SPK1.2
N$13  (via drill 0.3, 0.3 pad 0.6)
  Top 0.2: IC1.37 27.86,26.83 27.22,26.83 26.22,25.83 25.47,25.83 v25.37,25.73 25.27,25.73 25.12,25.58 24.77,25.58 C23.1 24.47,25.94 | Q2.1 28.34,19.96 v28.52,19.48
  Bottom 0.2: v28.52,19.48 25.12,22.88 25.12,23.63 25.67,24.18 25.67,25.43 v25.37,25.73
N$14
  Top 0.2: L6.1 27.57,31.48 28.57,31.48 28.62,31.43 C14.1 29.17,31.08 29.17,30.61 IC1.30
N$15
  Top 0.2: 27.42,30.13 L4.1 27.51,30.08 28.57,30.08 IC1.32
  Top 0.3: C6.1 27.42,30.13
N$16
  Top 0.2: 25.27,29.38 C12.1 | C6.2
  Top 0.3: L5.1 C6.2 | C12.1 C6.2
N$17
  Top 0.2: U$2.FEED 20.58,28.53 | L5.2 24.62,27.43 24.32,27.13 24.07,26.89 C13.1
  Top 0.45: U$2.FEED 21.07,28.78
  Top 0.8: 21.07,28.78 22.26,28.78 arc-45 22.96,28.49 24.32,27.13
N$18
  Top 0.2: IC1.31 28.38,30.84 L4.2 28.12,30.78 26.87,30.78 L6.2
N$19
  Top 0.2: IC1.39 28.19,26.03 27.52,26.03 27.02,25.53 27.02,24.79 C19.1
N$20
  Top 0.2: C21.1 22.72,62.22 22.72,62.03 23.16,61.59 Q3.1 25.17,61.93 26.37,64.33 27.02,64.63 27.57,64.63 28.52,63.68 IC4.17
N$21
  Top 0.4: Q4.1 59.72,39.38 R21.2
N$22
  Top 0.2: C10.1 29.57,31.88 29.57,30.78 IC1.29
N$23  (via drill 0.3 pad 0.6)
  Top 0.15: R31.1 28.87,23.03 28.67,23.23 v28.67,23.73
  Top 0.2: U1.2 25.2,38.16 23.82,36.78 23.82,35.98 23.12,35.28 v23.12,34.38
  Bottom 0.2: v28.67,23.73 28.42,23.73 27.07,25.08 27.07,25.48 27.52,25.93 28.77,25.93 31.17,28.33 31.17,29.33 29.67,30.83 29.67,31.83 27.82,33.68 23.82,33.68 v23.12,34.38
N$24
  Top 0.2: C33.1 60.37,45.83 IC5.3 R43.2 R42.1
N$25
  Top 0.3: USB2.1 45.49,62.41 46.62,61.28 46.62,59.13 L2.1
N$26  (via drill 0.3 pad 0.6)
  Top 0.2: USB2.3 42.77,60.33 v42.57,60.13 43.61,59.09 D1.6 | D1.6 43.53,58.85 L1.1 | D1.1 D1.6
  Bottom 0.2: TP13.TP 42.22,60.48 v42.57,60.13
N$27  (via drill 0.3)
  Top 0.15: IC4.19 28.02,62.68 v27.82,62.48
  Top 0.2: IC4.19 28.57,62.73 | C11.1 33.97,56.93 33.32,56.93 v33.07,57.18 | C11.1 R35.2 | C11.1 34.02,57.98 R44.1 34.92,58.03 R36.1
  Bottom 0.15: v27.82,62.48 27.37,62.48 25.72,60.83 25.72,59.43 27.77,57.38 32.87,57.38 v33.07,57.18
N$28  (via drill 0.3 pad 0.6)
  Top 0.2: USB2.2 43.42,60.33 v43.62,60.13 44.32,60.13 44.72,59.73 44.72,58.87 D1.4 D1.3 44.61,57.62 44.22,57.23 42.87,57.23 42.07,58.04 L1.4
  Bottom 0.2: TP14.TP 43.97,60.48 v43.62,60.13
N$29
  Top 0.2: R40.1 R41.2 59.02,46.88 IC5.4
N$30
  Top 0.2: C32.1 R40.2
N$31
  Top 0.2: C32.2 54.54,47.51 MIC1.4
N$32
  cutout Top: 20.67,29.33 20.82,29.43 22.33,29.43 arc-45 23.42,28.98 24.3,28.08 25.07,28.88 24.37,29.58 27.77,32.93 28.22,33.38 29.07,33.38 31.32,31.13 30.97,30.73 27.47,27.23 26.47,27.23 25.97,27.73 23.17,24.93 22.37,26.33 23.32,27.18 22.37,28.13 21.37,28.13
N$33
  Top 0.2: L1.3 38.94,58.04 R46.1
N$34
  Top 0.2: L1.2 38.95,58.85 R47.1
N$39
  cutout Top: 33.27,25.78 33.77,26.28 33.92,26.13 33.42,25.63
P0  (via drill 0.3)
  Top 0.2: EXP1.24 29.07,12.16 29.07,14.58 31.82,17.33 31.82,18.38 32.37,18.93 32.37,19.48 33.07,20.18 33.07,22.43 34.07,23.43 34.07,24.02 IC1.4 | R6.1 20.77,35.93 v20.77,35.38
  Bottom 0.2: P_0.1 4.8,37.71 7.82,40.73 15.02,40.73 20.37,35.38 v20.77,35.38 22.87,33.28 27.72,33.28 29.27,31.73 29.27,30.63 30.77,29.13 30.77,28.48 28.57,26.28 27.32,26.28 26.62,25.58 26.62,23.78 32.22,18.18 32.22,14.73 31.62,14.13 31.62,11.53 31.25,11.16 EXP1.24
P1  (via drill 0.3)
  Top 0.2: IC1.5 34.47,24.18 34.47,23.28 33.47,22.28 33.47,19.98 32.77,19.28 32.77,18.68 32.22,18.13 32.22,16.8 v31.65,16.23 31.32,16.23 30.07,14.98 EXP1.23 | EXP1.23 30.09,13.68 | P_1.1 29.06,10.08 31.27,10.08 31.62,10.43 31.62,11.18 30.07,12.73 EXP1.23 | R7.1 31.57,19.14 31.57,18.83 31.22,18.48 v31.22,18.33
  Bottom 0.2: v31.65,16.23 31.65,17.9 v31.22,18.33
P2
  Top 0.2: P_2.1 58.43,8.03 45.82,8.03 44.07,9.78 41.47,9.78 39.72,8.03 35.74,8.03 EXP1.22 32.62,12.23 31.62,13.23 31.62,14.13 32.62,15.13 32.62,17.98 33.42,18.78 33.97,18.78 34.62,19.43 34.62,20.74 R19.1 34.22,21.45 34.22,22.48 34.87,23.13 34.87,24.35 IC1.6
P3  (via drill 0.3 pad 0.6)
  Top 0.2: C34.1 IC5.1 R41.1 57.17,45.78 56.47,45.08 56.47,43.78 51.72,39.03 51.72,36.88 46.67,31.83 43.52,31.83 42.67,30.98 v42.67,29.03 | v35.47,23.98 35.47,24.31 IC1.7
  Bottom 0.2: v35.47,23.98 36.12,23.33 38.57,23.33 40.82,25.58 42.07,25.58 42.67,26.18 v42.67,29.03
P4  (via drill 0.3 pad 0.6)
  Top 0.2: EXP1.20 33.57,12.74 33.57,14.38 33.02,14.93 33.02,17.83 33.57,18.38 34.17,18.38 35.02,19.23 35.02,22.68 36.27,23.93 v36.27,24.08 IC1.8 | v42.02,29.58 42.02,34.03 R1.1
  Bottom 0.2: v36.27,24.08 36.27,24.03 36.57,23.73 38.37,23.73 40.62,25.98 41.87,25.98 42.27,26.38 42.27,28.48 42.02,28.73 v42.02,29.58
P5  (via drill 0.3 pad 0.6)
  Top 0.2: R8.1 v40.62,31.13 | IC1.9 36.23,24.68 36.62,24.68 36.97,24.33 v37.07,24.33 37.07,24.03 35.42,22.38 35.42,19.08 34.32,17.98 33.77,17.98 33.42,17.63 33.42,15.43 EXP1.19
  Bottom 0.2: v40.62,31.13 41.42,30.33 41.42,29.13 41.62,28.93 41.62,28.53 41.87,28.28 41.87,26.63 41.62,26.38 40.47,26.38 38.42,24.33 v37.07,24.33
P6  (via drill 0.3 pad 0.6)
  Top 0.2: IC1.10 36.4,25.08 v37.17,25.08 37.67,24.58 37.67,23.93 37.47,23.73 37.47,17.68 37.27,17.48 37.27,14.73 36.72,14.18 36.72,12.13 EXP1.18 | R9.1 39.47,31.87 39.47,30.23 39.67,30.03 39.67,27.83 40.02,27.48 40.02,26.83 v39.52,26.33
  Bottom 0.2: v37.17,25.08 38.27,25.08 v39.52,26.33
P7  (via drill 0.3 pad 0.6)
  Top 0.2: IC1.11 35.97,26.08 v36.52,26.08 36.97,25.63 37.47,25.63 38.02,25.08 38.02,23.68 37.87,23.53 37.87,17.43 37.69,17.25 EXP1.17 | v39.47,27.18 39.27,27.38 39.27,29.88 39.08,30.07 39.08,34.2 R10.1
  Bottom 0.2: v36.52,26.08 38.37,26.08 v39.47,27.18
P8
  Top 0.15: R11.1 38.46,31.32 37.57,30.43 37.27,30.43 36.62,29.78 36.22,29.78 35.82,29.38 35.82,29.13 IC1.14
  Top 0.2: EXP1.16 39.19,11.16 38.67,11.68 38.67,14.13 38.12,14.68 38.12,17.03 38.62,17.53 39.57,17.53 40.02,17.98 40.02,19.33 39.57,19.78 38.82,19.78 38.27,20.33 38.27,23.33 38.37,23.43 38.37,25.33 38.07,25.63 38.07,28.88 37.62,29.33 37.62,30.38 37.57,30.43
P9  (via drill 0.3 pad 0.6)
  Top 0.15: v37.8,31.73 37.8,31.16 37.37,30.73 37.07,30.73 36.42,30.08 36.07,30.08 35.42,29.43 35.42,29.28 34.95,28.81 IC1.15
  Top 0.2: v37.8,31.73 R12.1 | EXP1.15 40.22,17.33 40.42,17.53 40.42,19.48 39.72,20.18 39.02,20.18 38.67,20.53 38.67,23.18 38.77,23.28 38.77,25.58 38.47,25.88 38.47,29.03 38.02,29.48 38.02,30.03 v38.47,30.48
  Bottom 0.2: v38.47,30.48 38.47,31.05 v37.8,31.73
P10  (via drill 0.3 pad 0.6)
  Top 0.15: 37.13,31.27 37.13,31.28 | 34.98,29.43 34.98,29.45 35.12,29.58 35.12,29.63 35.92,30.43 36.24,30.43 v37.13,31.32
  Top 0.2: EXP1.12 43.82,12.7 43.82,14.23 42.57,15.43 42.57,19.13 41.92,19.78 40.67,19.78 39.87,20.58 39.22,20.58 39.07,20.73 39.07,22.98 39.17,23.08 39.17,25.73 38.87,26.03 38.87,29.43 v38.62,29.68 | v37.13,31.32 37.13,31.28 | R13.1 37.13,31.27 | 34.98,29.43 IC1.16
  Bottom 0.2: 37.13,31.28 v37.13,31.32 37.87,30.58 37.87,30.28 38.22,29.93 38.37,29.93 v38.62,29.68
P11  (via drill 0.3 pad 0.6)
  Top 0.15: IC1.17 35.77,30.78 36.02,30.78 36.47,31.23 v36.47,31.72 v36.46,31.73
  Top 0.2: v36.46,31.73 R14.1 | IC1.17
  Bottom 0.2: v36.46,31.73 37.06,32.33 40.32,32.33 45.12,27.53 45.12,16.08 45.31,15.89 EXP1.11
P12  (via drill 0.3 pad 0.6)
  Top 0.15: IC1.18 34.7,30.28 34.77,30.28 35.42,30.93 35.42,30.96 v35.79,31.33
  Top 0.2: v35.79,31.33 R15.1 | 34.1,29.66 IC1.18
  Bottom 0.2: EXP1.10 46.32,12.69 46.32,14.13 45.72,14.73 45.72,16.08 45.52,16.28 45.52,27.68 40.47,32.73 36.47,32.73 36.07,32.33 36.08,32.33 35.79,32 v35.79,31.33
P13  (via drill 0.3 pad 0.6)
  Top 0.15: IC1.19 34.44,30.58 34.62,30.58 35.12,31.08 v35.12,31.73
  Top 0.2: v35.12,31.73 R16.1
  Bottom 0.2: v35.12,31.73 35.12,31.83 35.92,32.73 36.32,33.13 40.62,33.13 45.97,27.78 45.97,20.83 47.67,19.13 47.67,16.03 47.85,15.85 EXP1.9
P14  (via drill 0.3 pad 0.6)
  Top 0.15: 34.46,31.16 IC1.20
  Top 0.2: R17.1 v34.46,31.18 34.46,31.16
  Bottom 0.2: v34.46,31.18 R17.1 35.69,33.53 40.82,33.53 46.37,27.98 46.37,21.08 48.07,19.38 48.07,16.28 48.27,16.08 48.27,14.78 48.82,14.23 48.82,12.73 EXP1.8
P15  (via drill 0.3 pad 0.6)
  Top 0.15: R18.1 33.87,34.16 33.87,32.56 v33.64,32.33 33.87,32.1 33.87,31.13 33.25,30.51 IC1.21
  Bottom 0.2: EXP1.7 50.39,18.96 49.57,19.78 48.32,19.78 46.77,21.33 46.77,28.18 42.97,31.98 41.07,33.93 35.52,33.93 33.92,32.33 v33.64,32.33
P16  (via drill 0.3, 0.3 pad 0.6)
  Top 0.15: v33.32,33.08 33.07,32.83 33.07,32.08 33.42,31.73 33.42,31.28 32.95,30.81 IC1.22
  Top 0.2: v47.42,26.63 47.57,26.48 54.72,26.48 56.77,28.53 56.77,32.38 64.07,39.68 64.71,39.68 R2.1 66.58,41.55 66.58,41.86 | TAST_B.4 66.58,41.86 | 66.58,41.86 72.11,47.39 TAST_B.3
  Bottom 0.2: v47.42,26.63 47.42,28.08 41.17,34.33 35.37,34.33 34.12,33.08 v33.32,33.08
P17  (via drill 0.3)
  Top 0.15: IC1.25 31.02,31.59 31.02,32.48 32.57,34.03 32.57,36.13 30.57,38.13 v30.57,39.13
  Top 0.2: R3.1 20.36,37.29 18.52,39.13 18.52,41.18 19.19,41.85 TAST_A.3 13.53,47.75 TAST_A.4 | 20.48,37.29 R3.1 | R3.1 20.38,37.09 19.72,36.43 19.72,35.43 20.37,34.78 22.02,34.78 23.41,36.17 v23.41,37.19
  Bottom 0.2: v30.57,39.13 30.27,39.43 27.77,39.43 25.02,36.68 23.92,36.68 v23.41,37.19
P18  (via drill 0.3 pad 0.6)
  Top 0.15: v32.02,34.48 32.02,34.03 30.67,32.68 30.67,31.38 IC1.26
  Top 0.2: LED1.1 41.37,30.06 41.37,30.03 41.42,30.08 v41.42,34.93
  Bottom 0.2: v41.42,34.93 41.22,34.73 35.22,34.73 35.02,34.53 32.17,34.53 v32.02,34.48
P19
  Top 0.15: IC1.27 30.69,30.81 30.37,31.13 30.37,32.53 29.22,33.68 27.42,33.68 26.97,34.13 26.97,34.83 R24.1
P20
  Top 0.15: R23.1 26.12,34.48 27.22,33.38 29.07,33.38 30.07,32.38 30.07,30.85 IC1.28
P21  (via drill 0.3, 0.3 pad 0.6)
  Top 0.2: v25.62,44.33 R32.1 26.82,43.23 28.57,41.48 R29.1 28.57,39.28 v28.12,38.83 | R30.1 20.87,38.48 v20.87,38.88 20.67,38.88 | IC1.40 28.26,25.53 27.92,25.53 v27.77,25.33
  Bottom 0.2: v28.12,38.83 28.32,39.03 29.82,39.03 30.67,38.18 30.67,37.53 28.87,35.73 28.87,33.18 30.07,31.98 30.07,30.98 31.52,29.53 31.52,28.13 28.72,25.33 v27.77,25.33 | v25.62,44.33 24.52,43.23 21.42,43.23 19.92,41.73 19.92,39.68 20.72,38.88 v20.87,38.88
P22  (via drill 0.3 pad 0.6)
  Top 0.2: EXP1.21 32.61,12.89 33.87,11.63 33.87,10.43 35.87,8.43 39.57,8.43 41.32,10.18 44.22,10.18 45.97,8.43 55.57,8.43 57.32,10.18 58.92,10.18 61.57,12.83 61.57,17.88 65.87,22.18 65.87,27.03 67.17,28.33 72.34,28.33 74.05,30.04 74.05,35.32 73.35,36.02 73.35,36.19 R20.1 73.35,36.33 73.51,36.33 74.84,37.66 P_3.1 | IC1.41 27.47,24.18 v27.47,23.88
  Bottom 0.2: EXP1.21 32.61,18.39 27.47,23.53 v27.47,23.88
P23
  Top 0.15: R31.2 29.32,20.68 29.77,20.38 R48.1
  Top 0.2: R31.2 28.42,22.33 28.22,22.78 28.07,23.73 28.17,24.28 28.17,24.31 IC1.42
P24  (via drill 0.3 pad 0.6)
  Top 0.15: IC1.43 29.12,24.7 v29.12,24.38
  Top 0.2: v30.72,50.23 30.72,50.43 30.37,50.78 30.37,51.73 29.42,52.68 R39.2
  Bottom 0.2: v30.72,50.23 31.12,49.83 31.12,37.38 29.27,35.53 29.27,33.33 30.47,32.13 30.47,31.13 31.92,29.68 31.92,27.93 29.12,25.13 v29.12,24.38
P25  (via drill 0.3 pad 0.6)
  Top 0.15: IC1.44 29.67,24.68 29.67,23.88 v29.47,23.68
  Top 0.2: v31.07,50.98 31.07,52.13 R38.2
  Bottom 0.2: v31.07,50.98 31.52,50.53 31.52,37.18 29.67,35.33 29.67,33.53 30.87,32.33 30.87,31.28 32.32,29.83 32.32,27.73 29.72,25.13 29.72,23.93 v29.47,23.68
P26  (via drill 0.3 pad 0.6)
  Top 0.15: IC1.45 30.02,24.47 30.02,23.28 v29.67,22.93 29.67,22.33 C42.1
  Top 0.2: v58.87,52.23 58.87,52.93 R27.1
  Bottom 0.2: EXP1.6 52.97,11.12 52.97,10.53 51.42,8.98 46.87,8.98 45.77,10.08 44.72,10.08 44.02,10.78 44.02,11.73 43.57,12.18 42.32,12.18 41.37,13.13 41.37,15.58 40.72,16.23 36.37,16.23 34.22,18.38 33.17,18.38 29.67,21.88 v29.67,22.93 30.17,23.43 30.17,25.03 32.72,27.58 32.72,29.98 31.27,31.43 31.27,32.48 30.07,33.68 30.07,35.13 31.97,37.03 31.97,50.68 35.22,53.93 51.72,53.93 54.72,50.93 57.57,50.93 v58.87,52.23
P27  (via drill 0.3 pad 0.6)
  Top 0.15: IC1.46 30.37,24.25 30.37,23.18 v30.62,22.93 C41.1
  Top 0.2: 60.02,52.93 R28.1 v59.92,52.13
  Bottom 0.2: EXP1.5 52.92,12.53 51.92,11.53 51.92,10.08 51.22,9.38 47.17,9.38 46.57,9.98 46.57,11.73 45.67,12.63 42.42,12.63 41.77,13.28 41.77,15.78 40.92,16.63 36.62,16.63 34.47,18.78 33.37,18.78 30.62,21.53 v30.62,22.93 30.62,24.93 33.12,27.43 33.12,30.13 31.67,31.58 31.67,32.63 30.47,33.83 30.47,34.93 32.37,36.83 32.37,50.43 35.47,53.53 51.47,53.53 54.47,50.53 58.32,50.53 v59.92,52.13
P28  (via drill 0.3 pad 0.6)
  Top 0.15: v31.92,22.68 31.62,22.68 30.67,23.63 30.67,23.99 IC1.47
  Top 0.2: v40.92,23.28 41.12,23.28 41.42,23.58 IC3.7
  Bottom 0.2: v40.92,23.28 40.22,23.28 39.62,22.68 39.62,21.93 38.72,21.03 35.02,21.03 33.57,22.48 32.12,22.48 v31.92,22.68
P29  (via drill 0.3 pad 0.6)
  Top 0.2: v40.92,24.08 IC3.6 | v31.82,23.48 31.78,23.48 IC1.48
  Bottom 0.2: v40.92,24.08 40.47,24.08 39.22,22.83 39.22,22.13 38.52,21.43 35.17,21.43 33.72,22.88 32.67,22.88 32.07,23.48 v31.82,23.48
P30  (via drill 0.3, 0.3 pad 0.6)
  Top 0.2: v41.02,24.88 41.32,24.58 IC3.5 | v33.47,23.68 33.47,24.05 IC1.3
  Bottom 0.2: v41.02,24.88 40.72,24.88 38.82,22.98 38.82,22.28 38.37,21.83 35.32,21.83 v33.47,23.68
RESET_SW  (via drill 0.3)
  Top 0.15: TAST_RESET.4 TAST_RESET.3 51.77,63.23 51.77,63.03 50.77,62.03 49.37,62.03 48.67,61.33 48.67,59.73 48.87,59.53 49.47,59.53 49.62,59.38 v50.07,59.38 R22.1 | IC4.21 28.37,61.68 27.62,60.93 v27.22,60.93 | C20.1 27.58,58.12 28.29,58.83 v28.32,58.83
  Bottom 0.15: v28.32,58.83 26.87,58.83 26.12,59.58 26.12,60.43 26.57,60.88 27.17,60.88 v27.22,60.93 28.07,60.93 29.27,59.73 33.67,59.73 34.27,59.13 34.27,58.33 34.77,57.83 34.77,57.13 35.47,56.43 46.87,56.43 49.52,59.08 49.77,59.08 v50.07,59.38
RX
  Top 0.2: R27.2 58.92,54.08 59.97,55.13 61.23,55.13 61.35,55.25 SERIAL.1
SCK  (via drill 0.3)
  Top 0.15: IC4.30 31.87,55.38 v32.22,55.03 | IC6.6 56.32,60.2 v56.32,61.43
  Bottom 0.15: v32.22,55.03 32.37,54.88 33.47,54.88 33.67,54.68 52.07,54.68 54.27,52.48 55.02,52.48 59.27,56.73 59.27,58.73 58.97,59.03 56.97,59.03 56.32,59.68 v56.32,61.43
SCL/P19  (via drill 0.3 pad 0.6)
  Top 0.2: R26.1 R24.2 v27.12,36.83 | U1.9 v20.97,40.53 20.97,49.83 21.28,49.83 I2C.1 | EXP1.3 55.47,15.13 50.52,20.08 v50.52,22.98 | v30.02,37.73 32.02,35.73 v32.02,35.68
  Top 0.254: v20.97,40.53
  Bottom 0.2: v30.02,37.73 28.02,37.73 v27.12,36.83 26.12,35.83 23.37,35.83 22.12,37.08 22.12,39.38 v20.97,40.53 | v50.52,22.98 49.87,22.98 48.57,24.28 48.57,28.08 42.42,34.23 42.42,35.33 41.82,35.93 40.97,35.93 40.57,35.53 34.87,35.53 34.67,35.33 33.87,35.33 33.52,35.68 v32.02,35.68
SDA/P20  (via drill 0.3, 0.3 pad 0.6)
  Top 0.2: R25.1 R23.2 v26.12,36.83 | U1.11 22.7,42.2 22.32,42.58 v21.72,42.58 21.52,42.78 21.52,47.08 23.32,48.88 23.32,50.43 22.15,51.6 I2C.2 | EXP1.4 54.47,12.21 54.47,15.53 49.92,20.03 v49.92,22.28 | v31.47,35.08 31.47,35.48 31.37,35.58 31.37,35.78 30.02,37.13 29.72,37.13 29.42,37.43 29.42,38.23 v29.62,38.43
  Bottom 0.2: v21.72,42.58 22.62,41.68 22.62,37.18 23.52,36.28 25.82,36.28 26.12,36.58 v26.12,36.83 27.47,38.18 29.37,38.18 v29.62,38.43 | v49.92,22.28 48.17,24.03 48.17,27.93 42.02,34.08 42.02,35.18 41.67,35.53 41.17,35.53 40.77,35.13 35.02,35.13 34.82,34.93 33.62,34.93 33.47,35.08 v31.47,35.08
SWCLK
  Top 0.2: TP1.TP 33.17,67.03 33.12,67.03 32.37,66.28 IC4.10 | IC4.10
SWDCLK  (via drill 0.3)
  Top 0.15: IC1.24 32.57,31.54 32.57,31.63 32.37,31.83 32.37,33.38 32.87,33.88 32.87,36.33 31.12,38.08 31.12,39.58 v30.52,40.18
  Top 0.2: IC4.26 29.87,56.78 31.07,55.58 31.07,53.98 TP7.TP 31.77,50.18 31.22,49.63 30.67,49.63 29.07,48.03 29.07,44.58 30.52,43.13 v30.52,42.13 | IC4.26
  Bottom 0.2: v30.52,40.18 v30.52,42.13
SWDIO
  Top 0.2: TP4.TP 31.17,65.68 30.87,65.38 IC4.13 | IC4.13
SWDIO/RESET
  Top 0.15: IC1.23 32.97,31.38 32.97,31.73 32.67,32.03 32.67,33.23 33.17,33.73 33.17,36.58 31.47,38.28 31.47,40.33 R37.1
  Top 0.2: IC4.27 | 32.17,48.98 TP8.TP | IC4.27 30.37,58.68 30.27,58.58 30.27,56.98 31.47,55.78 31.47,54.88 32.72,53.63 32.72,52.58 32.42,52.28 TP8.TP | R37.1 30.67,41.23 31.12,41.68 31.12,43.08 29.47,44.73 29.47,47.88 30.82,49.23 TP8.TP
TO_P24
  Top 0.2: 28.92,60.18 28.97,60.18 28.92,60.18 | 28.92,60.18 IC4.24 | 28.92,60.18 28.92,57.03 TP6.TP 29.07,55.48 29.07,54.68 29.42,54.33 R39.1
TO_P25
  Top 0.2: IC4.25 29.37,55.88 TP9.TP 30.37,54.88 R38.1
TX
  Top 0.2: SERIAL.2 62.03,53.44 61.82,53.23 60.82,53.23 60.02,54.03 R28.2
USB_DM
  Top 0.15: 37.26,57.82 37.97,58.53 37.97,59.63 37.67,59.93 36.47,59.93 35.77,60.63 35.07,60.63 34.02,61.68 IC4.4 | IC4.4
  Top 0.2: R46.2 37.23,57.17 C40.1 | R46.2 37.18,57.82 | R46.2 37.26,57.82
USB_DP
  Top 0.15: C39.1 36.08,59.82 35.67,60.23 34.82,60.23 33.87,61.18 IC4.3 | IC4.3
  Top 0.2: 37.07,59.28 37.23,59.28 R47.2 36.96,59.34 C39.1
USB_VREG  (via drill 0.3)
  Top 0.15: R22.2 51.17,60.08 51.17,61.33 52.17,62.33 v53.67,62.33
  Top 0.2: TP5.TP 60.57,42.63
  Top 0.25: 35.37,63.83 v36.37,63.83
  Top 0.3: 35.42,63.83 C4.1 35.37,63.83 | IC4.5 34.37,62.18 v34.62,61.93
  Top 0.305: IC4.5
  Top 0.4: v62.17,42.53 Q4.3 60.57,42.63
  Bottom 0.25: v36.37,63.83 36.82,63.38 36.82,62.13 37.12,61.83 37.12,60.93
  Bottom 0.4: v62.17,42.53 62.17,44.33 60.57,45.93 60.57,51.43 61.57,52.43 61.57,61.83 59.57,63.83 57.22,63.83 55.72,62.33 v53.67,62.33 49.07,62.33 47.97,61.23 46.87,61.23 45.37,62.73 39.97,62.73 38.17,60.93 37.12,60.93 35.62,60.93 v34.62,61.93
VCC  (via drill 0.3, 0.3 pad 0.6)  (1 unrouted)
  Top 0.15: 35.77,26.93 35.68,26.93 IC1.12 | C5.1 35.37,62.98 35.12,63.23 34.82,63.23 34.72,63.33 34.27,63.33
  Top 0.2: 34.02,20.25 R19.2 34.07,19.73 v33.72,19.38 | IC1.1 32.52,23.87 32.52,21.93 C7.1 32.57,21.78 32.57,20.53 v32.52,20.48 | IC1.35 28.22,28.73 27.97,28.48 | 27.97,28.48 27.97,28.42 IC1.36 | C9.1 27.08,28.48 | C9.1 27.02,28.23 v27.52,27.73 27.17,27.73 | 27.97,28.48 27.57,28.48 27.37,28.68 27.17,28.68 C9.1 | 30.22,19.43 30.17,19.48 29.92,19.23 | 29.32,19.23 v29.27,19.28 | C15.1 25.21,26.43 v25.97,26.43 | 28.12,34.93 28.12,34.28 28.17,34.23
  Top 0.25: C24.1 22.87,37.78 24.12,37.78 24.7,38.36 U1.3 24.7,39.61 23.7,40.61 U1.13 23.7,43.2 C2.1 | U1.7 22.7,38.41 C24.1 | R6.2 21.49,37.28 R3.2 21.48,38.22 R30.2 21.57,38.18 C24.1 | C37.1 v52.68,58.38 v52.67,58.39 52.67,59.03 52.87,59.23 52.87,59.93 | v58.66,58.38 59.27,58.38 59.72,58.83 | 52.87,59.93 53.12,60.18 IC6.8 | C38.1 52.47,59.93 52.87,59.93 | IC4.7 34.12,63.18 34.27,63.33 34.27,63.93 33.77,64.43 v33.77,65.93 | 24.88,51.05 24.88,51.14 25.77,52.03 25.77,52.53 R34.2 26.12,54.88 26.12,55.73 25.62,56.23 25.62,58.13 21.77,61.98 21.77,62.58 22.27,63.08 22.27,63.83 22.97,64.53 24.87,64.53 25.37,65.03 25.87,65.03 26.77,65.93 v28.32,65.93 28.82,65.93 R33.2 29.87,65.38 IC4.15
  Top 0.254: C24.1 22.42,38.23 | R25.2 v25.12,34.23
  Top 0.3: EXP1.2 56.72,12.45 56.72,14.98 54.27,17.43 Q1.2 | IC5.5 58.42,49.58 C36.1 | v40.92,22.43 41.02,22.38 41.72,23.08 IC3.8 | C36.1 59.37,49.23 61.52,49.23 | MIC1.1 55.72,51.81 C35.1 57.42,51.98 57.97,51.43 57.97,50.48 58.57,49.88 C36.1 | C8.1 37.17,27.73 v36.87,28.03 35.77,26.93 | R26.2 28.12,34.93 | v32.52,20.48 32.33,20.29 R7.2 31.08,20.29 30.92,20.13 30.92,19.28 | 29.92,19.23 29.32,19.23 | 30.92,19.28 30.92,19.03 30.57,18.68 30.57,16.74 EXP1.25 | R48.2 30.92,19.28 | R20.2 71.62,37.43 v64.02,37.43 64.02,38.48 64.45,38.91 R2.2
  Top 0.4: C17.1 22.92,43.33 C2.1 25.27,45.03 | 25.27,45.03 27.92,45.03 29.67,43.28 R37.2 29.67,39.63 29.62,39.58 | I2C.3 23.97,52.46 23.97,52.13 24.88,51.05 C29.1 C30.1 25.27,45.03 | 28.92,38.88 28.92,37.18 29.52,36.58 29.77,36.58 30.62,35.73 30.62,34.23 | 41.77,26.58 41.62,26.58 40.07,25.03 40.07,23.13 40.72,22.48 40.87,22.48 v40.92,22.43 | v64.02,40.48 61.77,40.48 Q4.2 | v27.67,34.23 28.17,34.23 30.62,34.23 | 30.62,34.23 v31.12,34.23
  Top 0.406: 28.92,38.88 29.62,39.58 | 55.42,24.73 55.12,24.73 C3.+
  Top 0.6: 53.9,23.5 C3.+ 53.93,24.68 v50.87,24.68 D3.A | 53.9,23.5 53.87,23.46 | 55.42,24.73 58.97,28.28 58.97,32.38 v64.02,37.43 | Q1.2 53.77,19.63 52.92,20.48 52.92,22.51 53.9,23.5 | 58.22,62.83 F1.1 57.89,62.11 | v64.02,40.48 C18.1 64.02,46.93 63.17,47.78 R42.2 61.52,49.23 C31.1 61.52,50.19 62.78,51.45 63.17,51.45 | v49.67,27.23 49.47,27.43 45.67,27.43 44.82,26.58 C1.1 41.77,26.58 v41.22,27.13 41.22,28.01 LED1.2 | 63.17,51.45 SERIAL.3 63.55,51.83 64.08,51.83 65.09,52.84 65.09,55.96 64.17,56.88 61.67,56.88 59.72,58.83 59.72,60.28 57.89,62.11 | 63.49,51.45 63.17,51.45 | 57.89,62.01 57.89,62.11
  Bottom 0.25: v52.68,58.38 v58.66,58.38 | v33.77,65.93 v28.32,65.93
  Bottom 0.3: v25.12,34.23 v27.67,34.23 | v29.27,19.28 29.27,20.43 26.12,23.58 26.12,26.28 v25.97,26.43 26.87,26.43 27.52,27.08 v27.52,27.73
  Bottom 0.4: v40.92,22.43 40.92,21.58 39.32,19.98 35.02,19.98 34.42,19.38 v33.72,19.38 33.02,20.08 32.92,20.08 v32.52,20.48
  Bottom 0.6: v49.67,27.23 50.87,25.63 v50.87,24.68 | v64.02,40.48 v64.02,37.43 | v31.12,34.23 32.42,32.93 32.42,31.93 36.32,28.03 v36.87,28.03 39.92,28.03 40.82,27.13 v41.22,27.13
VIN
  Top 0.5: 56.82,20.58 57.72,20.58 59.72,22.58 60.12,23.51 | 60.12,23.51 60.03,23.52 | TP10.TP 58.65,24.26 60.12,23.51
  Top 0.6: 56.82,20.58 Q1.3 | 60.03,23.52 BAT.1
VM
  Top 0.3: C16.1 C26.1 | C26.1 46.18,23.49 D3.C | IC3.1 45.77,23.08 C26.1
  Top 0.4: C16.1 45.87,20.51 46.58,19.8 JP1.5

## Text on the board
Top: Layer Top rev 2.0
Bottom: Layer Bot rev 2.0
tPlace: rev | 2.0
tStop: Stop Top rev 2.0
bStop: UL approval symbol | Manufacturing date in YYWW | Stop Bot rev 2.0
tCream: Paste Top rev 2.0
tDocu: P_GND | P_+3V | TAST_RESET | Q3 | 1 | IC6 | C | C | C | C | C | C | C | C | C | C | C | MIC1 | A tactile switch blue | B tactile switch red | C | C | C | C | C | TAST_B | C | C | C | C | C | TAST_A | P_0 | C | C | C | C | C | P_3 | SPK1 | IC3 | Q2 | 1 | + | P_1 | P_2 | Assembly Top rev 1.4
Notes: Sideplating in gold | Sideplating in gold | Sideplating in gold | Sideplating in gold | Sideplating in gold | Sideplating in gold
SilkscreenTop: Silkscreen Top rev 2.0
SilkscreenBot: /home/wowa/eagle/Calliope mini rev2.0_new/Silkscreen Bitmaps/Calliope_mini_2_0_Back_C.bmp | Silkscreen Bot rev 2.0